# EasyEDA Pro project iso.eprj

# Schematic Schematic1
Create Date: 2022-09-30; Project Name: iso; Schematic Name: Schematic1; Update Date: 2022-09-30
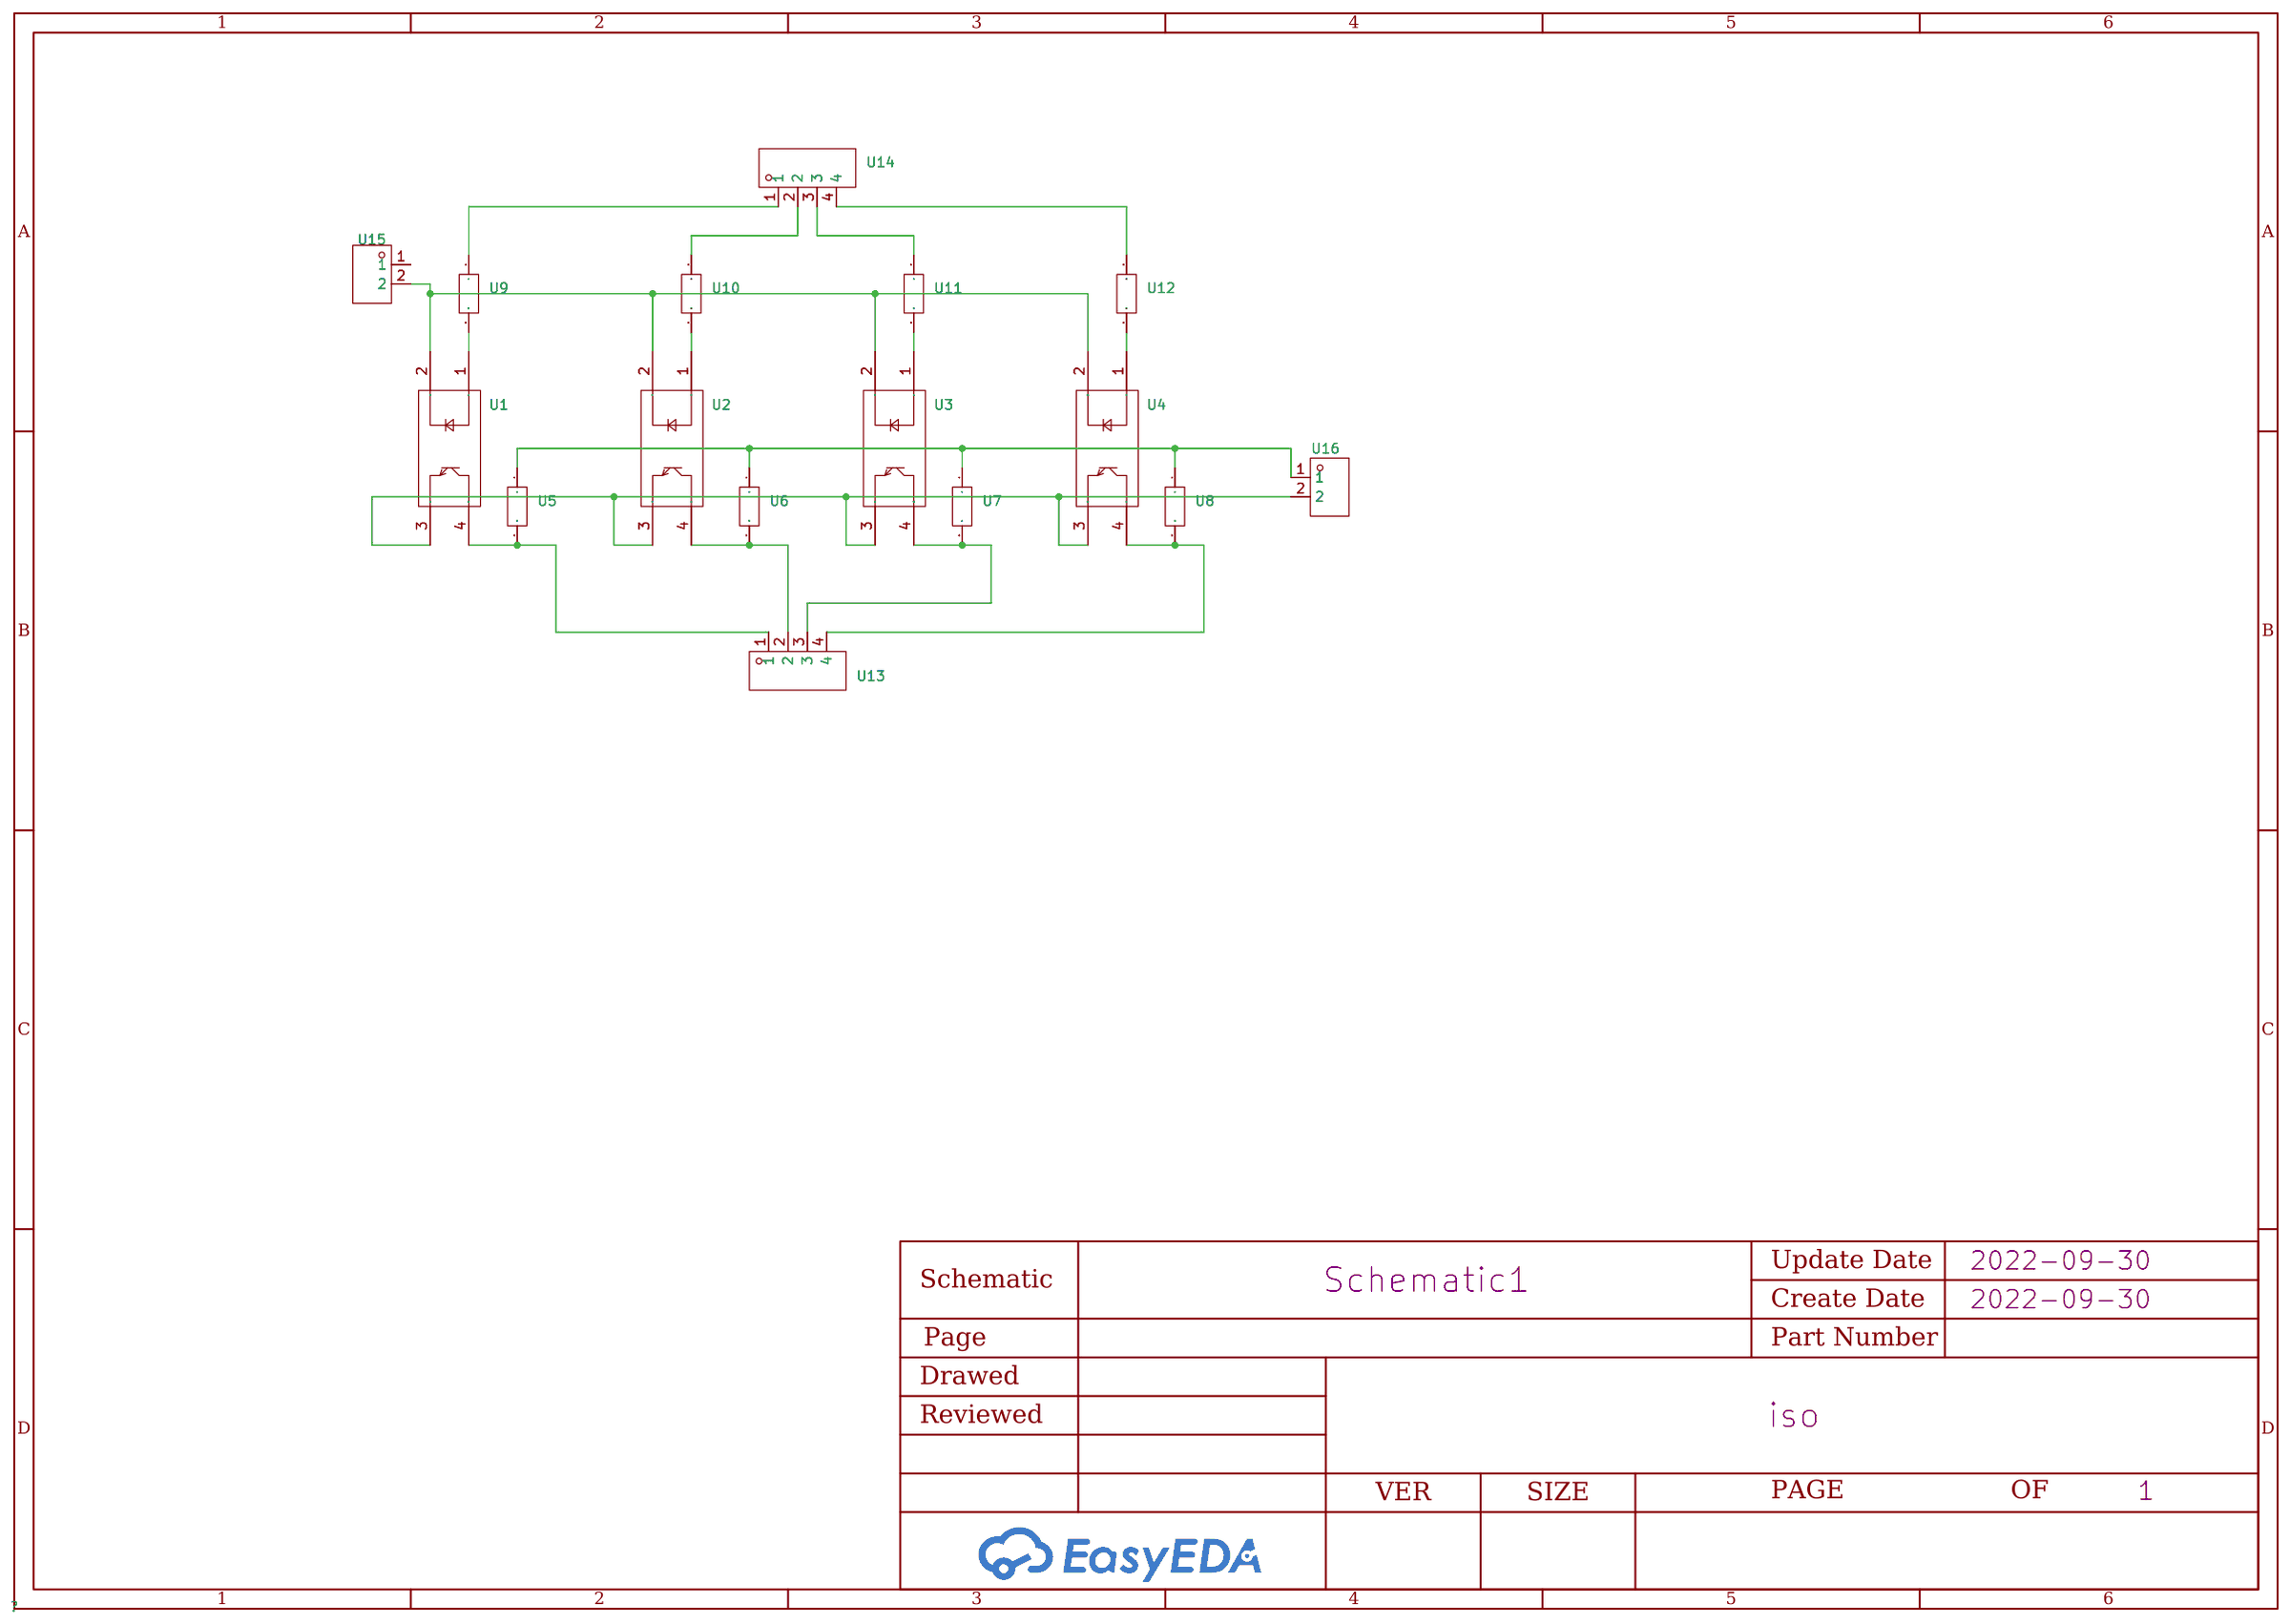
[diagram p0: schematic sheet]

## Parts
U1  -  [DIP-4_L4.6-W6.5-P2.54-LS7.6-BL]
U2  -  [DIP-4_L4.6-W6.5-P2.54-LS7.6-BL]
U3  -  [DIP-4_L4.6-W6.5-P2.54-LS7.6-BL]
U4  -  [DIP-4_L4.6-W6.5-P2.54-LS7.6-BL]
U5  -  [RES-TH_12R_2W]
U6  -  [RES-TH_12R_2W]
U7  -  [RES-TH_12R_2W]
U8  -  [RES-TH_12R_2W]
U9  -  [RES-TH_12R_2W]
U10  -  [RES-TH_12R_2W]
U11  -  [RES-TH_12R_2W]
U12  -  [RES-TH_12R_2W]
U13  -  [CONN-TH_DB125-2.54-4P-GN]
U14  -  [CONN-TH_DB125-2.54-4P-GN]
U15  -  [CONN-TH_DB125-2.54-2P-GN]
U16  -  [CONN-TH_DB125-2.54-2P-GN]

## Library data of the parts
U1-U4 = UPC817AG-D04-T: LCSC Part Name: UPC817AG DIP-4; Supplier Part: C2900480; Manufacturer: UTC(友顺); Supplier Footprint: DIP-4; JLCPCB Part Class: Extended Part; Datasheet: https://atta.szlcsc.com/upload/public/pdf/source/20210922/6859BEDC94C3DE597E1F827A5CB117A5.pdf; Supplier: LCSC
U5-U12 = Resistor_THT:R_Axial_DIN0309_L9.0mm_D3.2mm_P2.54mm_Vertical: Supplier Part: C9900016274; Supplier Footprint: 12R_2W; JLCPCB Part Class: Extended Part; Datasheet: https://atta.szlcsc.comnull; Supplier: LCSC
U13 U14 = DB125-2.54-4P-GN: Pitch:2.54mm Number of Rows:1 Number of PINs Per Row:4 Mounting Style:直针 Current Rating (Max):8A Voltage Rating (Max):130V Wire Gauge - AWG:18~26 Wire Gauge - mm?:0.5~1 Operating Temperature Range:-40~+105 Operating Temperature Range:-40~+105 Color:Gr; LCSC Part Name: 2.54mm 排数:1 每排P数:4 直针; Supplier Part: C918122; Manufacturer: DIBO(地博电气); Supplier Footprint: 直插,P=2.54mm; JLCPCB Part Class: Extended Part; Datasheet: https://atta.szlcsc.com/upload/public/pdf/source/20201111/C918120_C9DB7F6F3DB366529A80D61CABEEDAE6.pdf; Supplier: LCSC; Pitch: 2.54mm; Number of Rows: 1; Number of PINs Per Row: 4; Mounting Style: 直针; Current Rating (Max): 8A; Voltage Rating (Max): 130V; Wire Gauge - AWG: 18~26; Wire Gauge - mm?: 0.5~1; Operating Temperature Range: -40~+105; Color: Green
U15 U16 = DB125-2.54-2P-GN: Pitch:2.54mm Number of Rows:1 Number of PINs Per Row:2 Mounting Style:直针 Current Rating (Max):8A Voltage Rating (Max):130V Wire Gauge - AWG:18~26 Wire Gauge - mm?:0.5~1 Operating Temperature Range:-40~+105 Operating Temperature Range:-40~+105 Color:Gr; LCSC Part Name: 2.54mm 排数:1 每排P数:2 直针; Supplier Part: C918120; Manufacturer: DIBO(地博电气); Supplier Footprint: 直插,P=2.54mm; JLCPCB Part Class: Extended Part; Datasheet: https://atta.szlcsc.com/upload/public/pdf/source/20201111/C918120_C9DB7F6F3DB366529A80D61CABEEDAE6.pdf; Supplier: LCSC; Pitch: 2.54mm; Number of Rows: 1; Number of PINs Per Row: 2; Mounting Style: 直针; Current Rating (Max): 8A; Voltage Rating (Max): 130V; Wire Gauge - AWG: 18~26; Wire Gauge - mm?: 0.5~1; Operating Temperature Range: -40~+105; Color: Green

## Nets
$1N1587: U9.1 U14.1
$1N1592: U12.1 U14.4
$1N1597: U11.1 U14.3
$1N1607: U10.1 U14.2
$1N1614: U1.1(A) U9.2
$1N1617: U2.1(A) U10.2
$1N1620: U3.1(A) U11.2
$1N1623: U4.1(A) U12.2
$1N1861: U1.2(C) U2.2(C) U3.2(C) U4.2(C) U15.2
$1N1908: U1.4(COL) U5.2 U13.1
$1N1914: U2.4(COL) U6.2 U13.2
$1N1920: U3.4(COL) U7.2 U13.3
$1N1926: U4.4(COL) U8.2 U13.4
$1N1991: U5.1 U6.1 U7.1 U8.1 U16.1
$1N2112: U1.3(EM) U2.3(EM) U3.3(EM) U4.3(EM) U16.2

Not connected (* = marked no-connect by the designer): U15 1

# Board PCB1
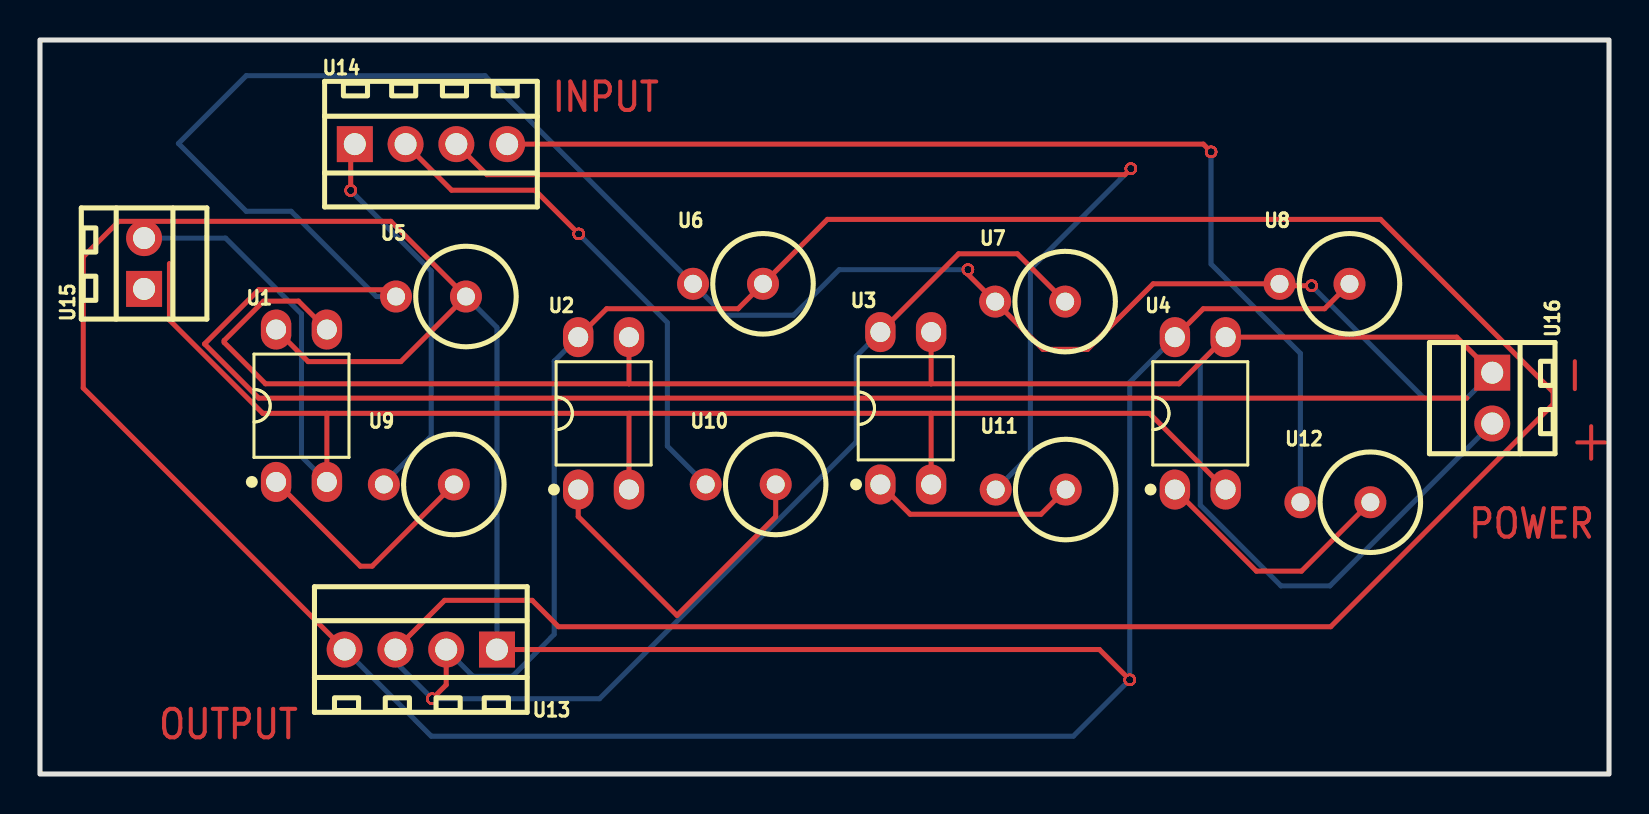
[diagram p1: board, top side]
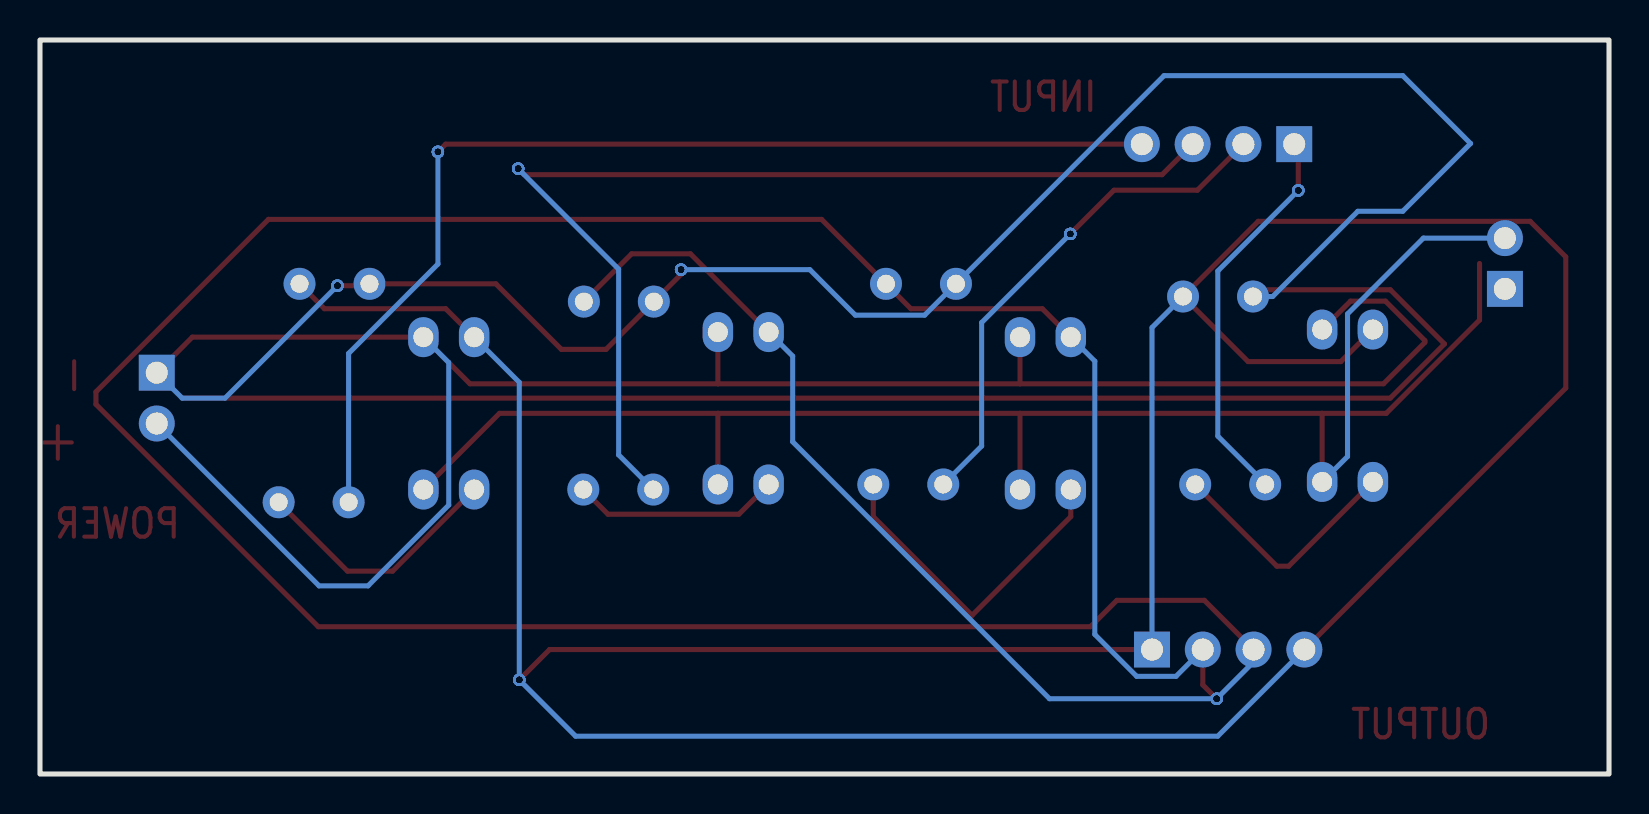
[diagram p2: board, bottom side, seen from below]

Outline 78.49 x 36.7 mm; copper layers: Top Layer, Bottom Layer. Coordinates in mm from the lower left corner of the outline.
Outline path: rectangle 0,36.7 78.49,0
Stack: Top Layer 0.035mm / Dielectric1 1.51mm FR4 er 4.5 / Bottom Layer 0.035mm

## Design rules (mm)
spacing safeClearance (default): track to track 0.152, other pairs 0.152 to 0.3
track width trackWidth (default): min 0.127, default 0.254, max 2.54
differential pair differentialPair (default): width min 0.127, default 0.254, max 2.54; gap min 0.152, default 0.152
via viaSize (default): diameter min 0.5, default 0.61, max 10; hole min 0.3, default 0.305, max 6

## Placement (name value [footprint] x y rotation side)
U1  -  [DIP-4_L4.6-W6.5-P2.54-LS7.6-BL]  13.08 18.41 0 top
U2  -  [DIP-4_L4.6-W6.5-P2.54-LS7.6-BL]  28.19 18.03 0 top
U3  -  [DIP-4_L4.6-W6.5-P2.54-LS7.6-BL]  43.31 18.29 0 top
U4  -  [DIP-4_L4.6-W6.5-P2.54-LS7.6-BL]  58.04 18.03 0 top
U5  -  [RES-TH_12R_2W]  19.56 23.88 0 top
U6  -  [RES-TH_12R_2W]  34.42 24.51 0 top
U7  -  [RES-TH_12R_2W]  49.53 23.62 0 top
U8  -  [RES-TH_12R_2W]  63.75 24.51 0 top
U9  -  [RES-TH_12R_2W]  18.95 14.48 0 top
U10  -  [RES-TH_12R_2W]  35.05 14.48 0 top
U11  -  [RES-TH_12R_2W]  49.56 14.22 0 top
U12  -  [RES-TH_12R_2W]  64.8 13.59 0 top
U13  -  [CONN-TH_DB125-2.54-4P-GN]  19.05 6.22 180 top
U14  -  [CONN-TH_DB125-2.54-4P-GN]  19.56 31.5 0 top
U15  -  [CONN-TH_DB125-2.54-2P-GN]  5.21 25.53 90 top
U16  -  [CONN-TH_DB125-2.54-2P-GN]  72.64 18.8 270 top

## Footprints (pads in the part's own frame, mm; a bottom-side part is the same pattern mirrored in y, then rotated)
CONN-TH_DB125-2.54-2P-GN
  rect 1.8x1.8 hole 1.1: 1(-1.27,0)
  round 1.8 hole 1.1: 2(1.27,0)
CONN-TH_DB125-2.54-4P-GN
  rect 1.8x1.8 hole 1.1: 1(-3.81,0)
  round 1.8 hole 1.1: 2(-1.27,0) 3(1.27,0) 4(3.81,0)
DIP-4_L4.6-W6.5-P2.54-LS7.6-BL
  oval 1.524x2 hole 1: 1(-1.27,-3.81) 2(1.27,-3.81) 3(1.27,3.81) 4(-1.27,3.81)
RES-TH_12R_2W
  round 1.6 hole 0.9: 1(-1.75,0) 2(1.75,0)

## Nets
As in the schematic.

Pads without a net: U15 1

## Via types
v1: diameter 0.61, hole 0.305, Top Layer to Bottom Layer, 128 vias

## Routing (per net, layer and track width the routed paths; a pad name or vN(x,y) marks a point on that pad's centre or on a via; arc(x,y) is an arc through that point)
$1N1587: length 19.8
  Top Layer w0.254: U14.1 15.54,31.29 v1(15.54,29.18)
  Bottom Layer w0.254: U9.1 17.2,14.53 19.57,16.9 19.57,25.15 v1(15.54,29.18)
$1N1592: length 54.7
  Top Layer w0.254: v1(58.58,31.11) 58.19,31.5 U14.4
  Bottom Layer w0.254: U12.1 63.05,21.03 58.58,25.5 v1(58.58,31.11)
$1N1597: length 53.3
  Top Layer w0.254: U14.3 22.36,29.97 54.27,29.97 v1(54.57,30.27)
  Bottom Layer w0.254: v1(54.57,30.27) 49.54,25.24 49.54,15.96 U11.1
$1N1607: length 25.7
  Top Layer w0.254: U14.2 20.59,29.19 24.76,29.19 v1(26.95,27.01)
  Bottom Layer w0.254: U10.1 31.38,16.4 31.38,22.57 v1(26.95,27.01)
$1N1614: length 12.3
  Top Layer w0.254: U9.2 16.62,10.39 16.02,10.39 U1.1
$1N1617: length 16.9
  Top Layer w0.254: 26.92,14.22 26.92,12.87 31.86,7.93 36.8,12.87 U10.2
$1N1620: length 10.4
  Top Layer w0.254: U11.2 50.07,12.99 43.53,12.99 U3.1
$1N1623: length 12.9
  Top Layer w0.254: U12.2 63.1,10.14 60.85,10.14 56.77,14.22
$1N1861: length 88.3
  Top Layer w0.254: 44.58,18.03 U3.2 ; 44.58,18.03 29.46,18.03 ; 44.58,18.03 55.5,18.03 59.31,14.22 ; 14.35,18.03 29.46,18.03 ; 14.35,18.03 U1.2 ; 14.35,18.03 11.14,18.03 6.48,22.7 6.48,25.53 ; 29.46,18.03 29.46,14.22
  Bottom Layer w0.254: U15.2 9.29,26.8 13.08,23 13.08,15.88 U1.2
$1N1908: length 76.3
  Top Layer w0.254: 15.24,6.22 2.16,19.3 2.16,25.86 3.94,27.64 17.55,27.64 U5.2 18.05,20.62 13.41,20.62 U1.4
  Bottom Layer w0.254: U5.2 22.86,22.32 U13.1
$1N1914: length 141.7
  Top Layer w0.254: 17.78,6.22 20.24,8.68 24.62,8.68 25.94,7.36 64.56,7.36 75.69,18.49 75.69,19.11 67.06,27.73 39.39,27.73 U6.2 34.92,23.27 28.35,23.27 U2.4
  Bottom Layer w0.254: U2.4 25.72,20.64 25.72,6.98 23.62,4.88 21.66,4.88 U13.2
$1N1920: length 50.3
  Top Layer w0.254: v1(19.62,3.76) 20.32,4.46 20.32,6.22 ; U7.2 48.89,26.01 45.95,26.01 U3.4
  Bottom Layer w0.254: U3.4 40.83,20.9 40.83,16.61 27.99,3.76 v1(19.62,3.76) 17.78,5.61 17.78,6.22
$1N1926: length 102.4
  Top Layer w0.254: U4.4 58.19,23.27 64.26,23.27 U8.2 ; 22.86,6.22 53,6.22 v1(54.51,4.71)
  Bottom Layer w0.254: U13.4 19.57,1.89 51.69,1.89 v1(54.51,4.71) 54.51,19.59 U4.4
$1N1991: length 168.2
  Top Layer w0.254: v1(63.61,24.42) 62.1,24.42 U8.1 55.68,24.51 52.4,21.23 50.17,21.23 U7.1 46.42,24.98 v1(46.42,25.22) ; 71.37,18.8 10.94,18.8 8.23,21.5 10.94,24.21 17.47,24.21 U5.1
  Bottom Layer w0.254: U5.1 16.83,23.88 12.57,28.14 10.32,28.14 6.93,31.53 10.32,34.92 22.26,34.92 U6.1 34.23,22.94 37.7,22.94 39.98,25.22 v1(46.42,25.22) ; v1(63.61,24.42) 69.23,18.8 71.37,18.8 U16.1
$1N2112: length 106.1
  Top Layer w0.254: 29.46,19.51 11.28,19.51 9.21,21.58 9.21,21.67 11.18,23.65 12.93,23.65 U1.3 ; 29.46,19.51 44.58,19.51 ; 29.46,19.51 U2.3 ; 44.58,19.51 56.98,19.51 U4.3 70.87,21.84 72.64,20.07 ; 44.58,19.51 U3.3
  Bottom Layer w0.254: U4.3 58.04,20.57 58.04,13.45 62.08,9.41 64.53,9.41 U16.2

## Text on the board
Top Layer: OUTPUT | INPUT | POWER | - | +
